# EAGLE design PCB-TLY-SHLD (EAGLE 6.4)
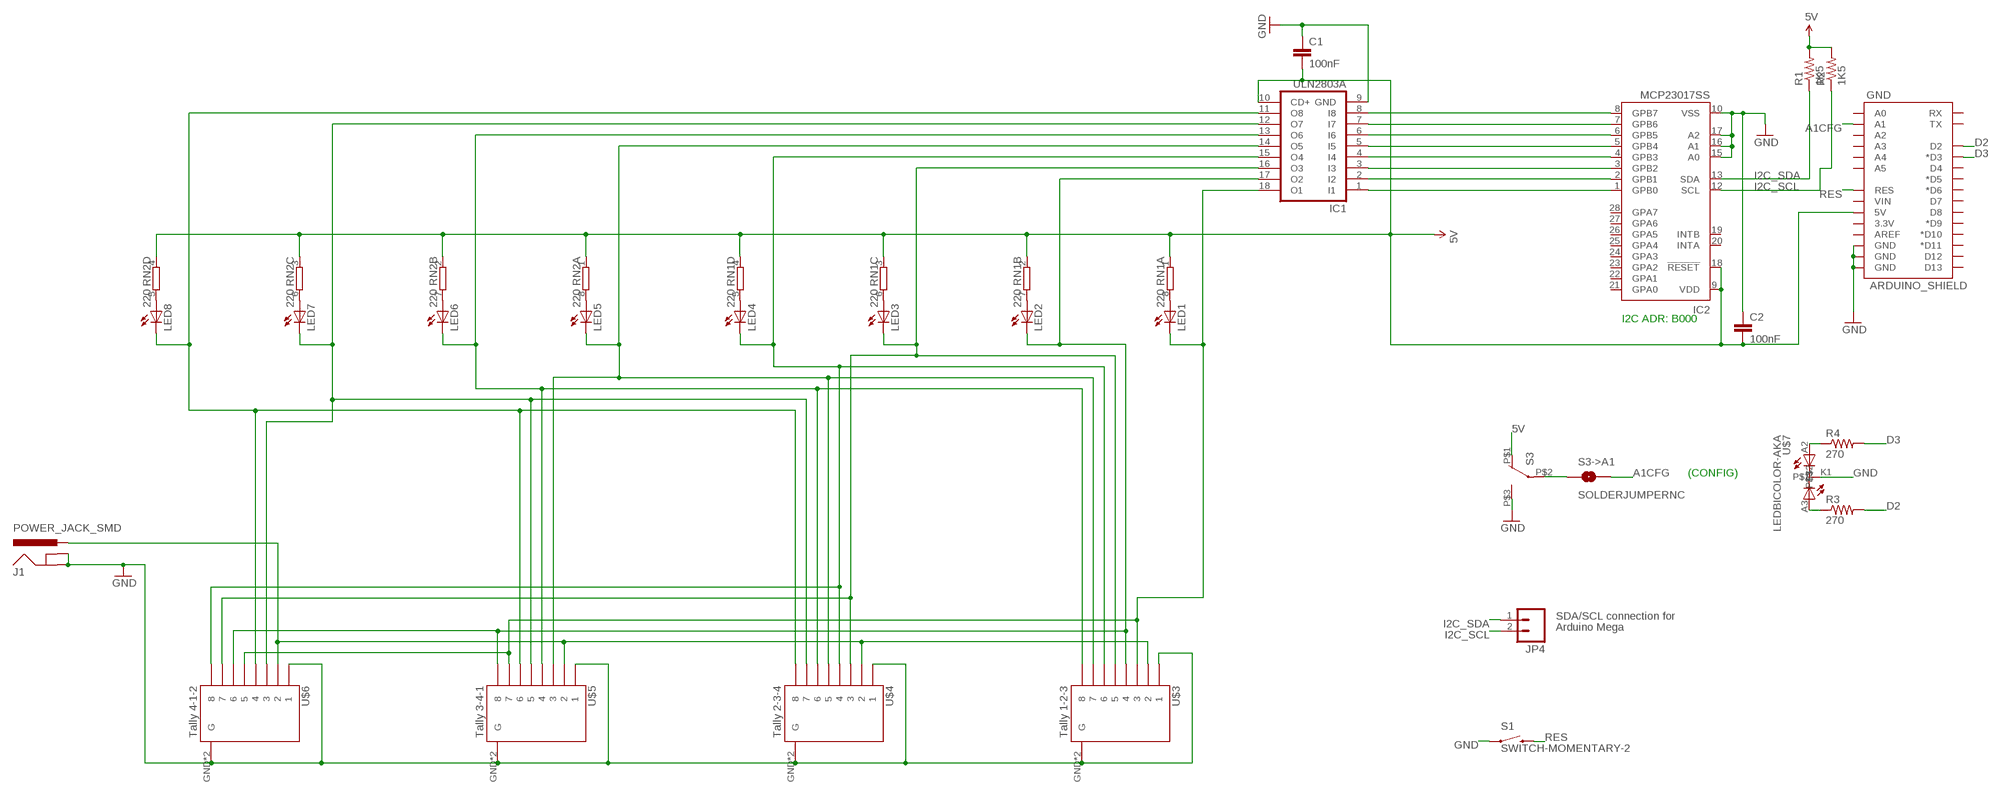
[diagram p0: schematic, sheet 1]

## Parts
C1  100nF  CAP0805  [0805]
C2  100nF  CAP0603-CAP  [0603-CAP]
GND  ARDUINO_SHIELD  [ARDUINO_BOXSHIELD_NOHOLES]
IC1  ULN2803A  ULN2803ASO18W  [SO18W]
IC2  MCP23017SS  [SSOP28]
J1  POWER_JACK_SMD  [POWER_JACK_SMD]
JP4  M02PTH  [1X02]
LED1  LEDSML0805  [SML0805]
LED2  LEDSML0805  [SML0805]
LED3  LEDSML0805  [SML0805]
LED4  LEDSML0805  [SML0805]
LED5  LEDSML0805  [SML0805]
LED6  LEDSML0805  [SML0805]
LED7  LEDSML0805  [SML0805]
LED8  LEDSML0805  [SML0805]
R1  1K5  RESISTOR0603-RES  [0603-RES]
R2  1K5  RESISTOR0603-RES  [0603-RES]
R3  270  RESISTOR0603-RES  [0603-RES]
R4  270  RESISTOR0603-RES  [0603-RES]
RN1  220  4R-NCAY16  [CAY16_HAND]
RN2  220  4R-NCAY16  [CAY16_HAND]
S1  SWITCH-MOMENTARY-2  [TACTILE_SWITCH_TALL]
S3  CFG  SWITCH-DPST  [TECONNECTIVITY-DPST]
S3->A1  SOLDERJUMPERNC  [SJ_2S]
U$3  Tally 1-2-3  RJ45-8_GND  [RJ45-8_GND]
U$4  Tally 2-3-4  RJ45-8_GND  [RJ45-8_GND]
U$5  Tally 3-4-1  RJ45-8_GND  [RJ45-8_GND]
U$6  Tally 4-1-2  RJ45-8_GND  [RJ45-8_GND]
U$7  LEDBICOLOR-AKA  [LED5MM-BICOLOR]

## Nets
5V [PWR]: C1.2 C2.2 GND.5V@0(5V) IC1.10(CD+) IC2.9(VDD) IC2.18(!RESET) R1.2 R2.2 RN1.1 RN1.2 RN1.3 RN1.4 RN2.1 RN2.2 RN2.3 RN2.4 S3.P$1(O)
A1CFG: GND.A1 S3->A1.2
D2: GND.2(D2) R3.2
D3: GND.3(*D3) R4.2
GND [PWR]: C1.1 C2.1 GND.GND@0(GND) GND.GND@1(GND) GND.GND@4(GND) IC1.9(GND) IC2.10(VSS) IC2.15(A0) IC2.16(A1) IC2.17(A2) J1.GND J1.SHUNT(GNDBREAK) S1.A2 S3.P$3(S) U$3.1 U$3.GND1(G) U$3.GND(G) U$4.1 U$4.GND1(G) U$4.GND(G) U$5.1 U$5.GND1(G) U$5.GND(G) U$6.1 U$6.GND1(G) U$6.GND(G) U$7.K1
I2C_SCL: IC2.12(SCL) JP4.2 R2.1
I2C_SDA: IC2.13(SDA) JP4.1 R1.1
N$2: IC1.18(O1) LED1.C U$3.3 U$5.7 U$6.5
N$3: S3->A1.1 S3.P$2(P)
N$4: J1.PWR U$3.2 U$4.2 U$5.2 U$6.2
N$5: IC1.1(I1) IC2.1(GPB0)
N$6: IC1.17(O2) LED2.C U$3.4 U$5.8 U$6.6
N$7: R4.1 U$7.A2
N$11: R3.1 U$7.A3
N$12: IC1.16(O3) LED3.C U$3.5 U$4.3 U$6.7
N$16: IC1.15(O4) LED4.C U$3.6 U$4.4 U$6.8
N$20: IC1.14(O5) LED5.C U$3.7 U$4.5 U$5.3
N$24: IC1.13(O6) LED6.C U$3.8 U$4.6 U$5.4
N$28: IC1.12(O7) LED7.C U$4.7 U$5.5 U$6.3
N$32: IC1.11(O8) LED8.C U$4.8 U$5.6 U$6.4
N$34: IC1.2(I2) IC2.2(GPB1)
N$35: IC1.3(I3) IC2.3(GPB2)
N$36: IC1.4(I4) IC2.4(GPB3)
N$37: IC1.5(I5) IC2.5(GPB4)
N$38: IC1.6(I6) IC2.6(GPB5)
N$39: IC1.7(I7) IC2.7(GPB6)
N$40: IC1.8(I8) IC2.8(GPB7)
N$41: LED1.A RN1.8
N$42: LED2.A RN1.7
N$43: LED3.A RN1.6
N$44: LED4.A RN1.5
N$45: LED5.A RN2.8
N$46: LED6.A RN2.7
N$47: LED7.A RN2.6
N$48: LED8.A RN2.5
RES: GND.RESET(RES) S1.B2
Unconnected: GND.0(RX) GND.1(TX) GND.3.3V GND.4(D4) GND.5(*D5) GND.6(*D6) GND.7(D7) GND.8(D8) GND.9(*D9) GND.10(*D10) GND.11(*D11) GND.12(D12) GND.13(D13) GND.A0 GND.A2 GND.A3 GND.A4 GND.A5 GND.AREF GND.VIN IC2.19(INTB) IC2.20(INTA) IC2.21(GPA0) IC2.22(GPA1) IC2.23(GPA2) IC2.24(GPA3) IC2.25(GPA4) IC2.26(GPA5) IC2.27(GPA6) IC2.28(GPA7)

## Notes on the sheet
- I2C ADR: B000
- (CONFIG)
- SDA/SCL connection for
- Arduino Mega

## Library data of the parts
C1 C2 = SparkFun:CAP: Capacitor Standard 0603 ceramic capacitor, and 0.1" leaded capacitor.
GND = SKAARHOJ:ARDUINO_SHIELD
IC1 = uln-udn:ULN2803A: DRIVER ARRAY
IC2 = microchip:MCP23017: http://ww1.microchip.com/downloads/en/DeviceDoc/21952a.pdf Source: http://ww1.microchip.com/downloads/en/DeviceDoc/21952a.pdf; MF: MICROCHIP; MPN: MCP23017-E/SS; OC_FARNELL: 1467674; OC_NEWARK: 31K2960
J1 = SKAARHOJ:POWER_JACK_SMD: RASM712PX Right Angle SMT Mount DC Power Jack, pin size 0.100"(2.5mm), with locating post Switchcraft.com
JP4 = SparkFun:M02: Header 2 Standard 2-pin 0.1" header. Use with straight break away headers (SKU : PRT-00116), right angle break away headers (PRT-00553), swiss pins (PRT-00743), machine pins (PRT-00117), and female headers (PRT-00115). Molex polarized connector foot print use with SKU : PRT-08233 with associated crimp pins and housings.
LED1-LED8 = led:LED: LED OSRAM: - CHIPLED LG R971, LG N971, LY N971, LG Q971, LY Q971, LO R971, LY R971 LH N974, LH R974 LS Q976, LO Q976, LY Q976 LO Q996 - Hyper CHIPLED LW Q18S LB Q993, LB Q99A, LB R99A - SideLED LS A670, LO A670, LY A670, LG A670, LP A670 LB A673, LV A673, LT A673, LW A673 LH A674 LY A675 LS A676, LA A676, LO A676, LY A676, LW A676 LS A679, LY A679, LG A679 - Hyper Micro SIDELED® LS Y876, LA Y876, LO Y876, LY Y876 LT Y87S - SmartLED LW L88C, LW L88S LB L89C, LB L89S, LG L890 LS L89K, LO L89K, LY L89K LS L896, LA L896, LO L896, LY L896 - TOPLED LS T670, LO T670, LY T670, LG T670, LP T670 LSG T670, LSP T670, LSY T670, LOP T670, LYG T670 LG T671, LOG T671, LSG T671 LB T673, LV T673, LT T673, LW T673 LH T674 LS T676, LA T676, LO T676, LY T676, LB T676, LH T676, LSB T676, LW T676 LB T67C, LV T67C, LT T67C, LS T67K, LO T67K, LY T67K, LW E67C LS E67B, LA E67B, LO E67B, LY E67B, LB E67C, LV E67C, LT E67C LW T67C LS T679, LY T679, LG T679 LS T770, LO T770, LY T770, LG T770, LP T770 LB T773, LV T773, LT T773, LW T773 LH T774 LS E675, LA E675, LY E675, LS T675 LS T776, LA T776, LO T776, LY T776, LB T776 LHGB T686 LT T68C, LB T68C - Hyper Mini TOPLED® LB M676 - Mini TOPLED Santana® LG M470 LS M47K, LO M47K, LY M47K Source: http://www.osram.convergy.de LUXEON: - LUMILED® LXK2-PW12-R00, LXK2-PW12-S00, LXK2-PW14-U00, LXK2-PW14-V00 LXK2-PM12-R00, LXK2-PM12-S00, LXK2-PM14-U00 LXK2-PE12-Q00, LXK2-PE12-R00, LXK2-PE12-S00, LXK2-PE14-T00, LXK2-PE14-U00 LXK2-PB12-K00, LXK2-PB12-L00, LXK2-PB12-M00, LXK2-PB14-N00, LXK2-PB14-P00, LXK2-PB14-Q00 LXK2-PR12-L00, LXK2-PR12-M00, LXK2-PR14-Q00, LXK2-PR14-R00 LXK2-PD12-Q00, LXK2-PD12-R00, LXK2-PD12-S00 LXK2-PH12-R00, LXK2-PH12-S00 LXK2-PL12-P00, LXK2-PL12-Q00, LXK2-PL12-R00 Source: www.luxeon.com KINGBRIGHT: KA-3528ASYC Source: www.kingbright.com
R1-R4 = SparkFun:RESISTOR: Resistor Basic schematic elements and footprints for 0603, 1206, and PTH resistors.
RN1 RN2 = SKAARHOJ:4R-N: Array Chip Resistor Source: RS Component / Phycomp; OC_FARNELL: unknown; OC_NEWARK: unknown
S1 = SparkFun:SWITCH-MOMENTARY-2
S3 = SKAARHOJ:SWITCH-DPST: DPDT Version of the COM-00597
S3->A1 = SparkFun:SOLDERJUMPER: Solder Jumper Standard SMD solder jumper. Used to automate production. Two varients : Normally Open and Normally Closed are the same, but have different paste layers. NC will have a large amount of paste and should jumper during reflow.
U$3-U$6 = SKAARHOJ:RJ45-8_GND
U$7 = SKAARHOJ:LEDBICOLOR-AKA

## Net classes
0 default: width 0.203 mm, drill 0.406 mm, clearance 0.203 mm
1 PWR: width 0.406 mm, drill 0.61 mm, clearance 0.203 mm
2 RELAY LINES: width 0.305 mm, clearance 0.254 mm
3 INput lines: clearance 0.254 mm

## Board
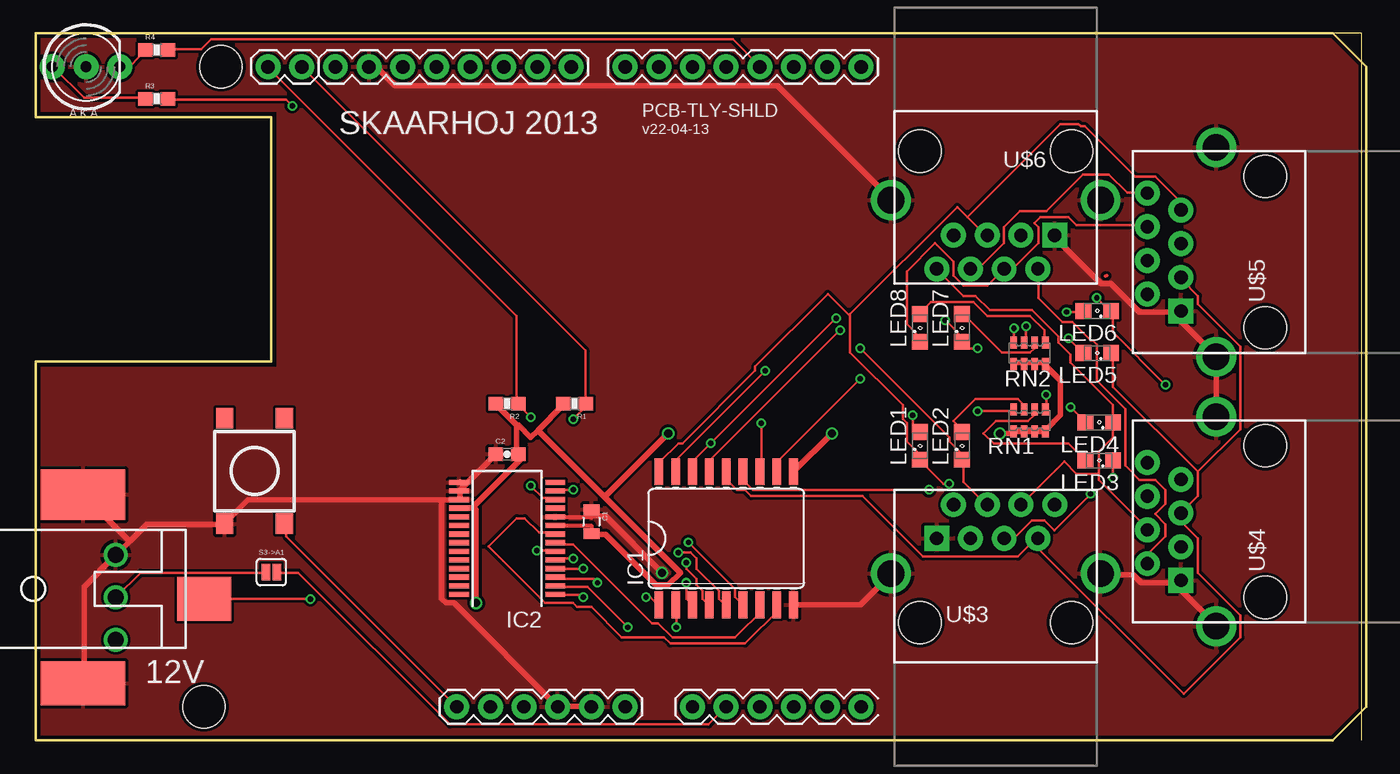
[diagram p1: board, top side]
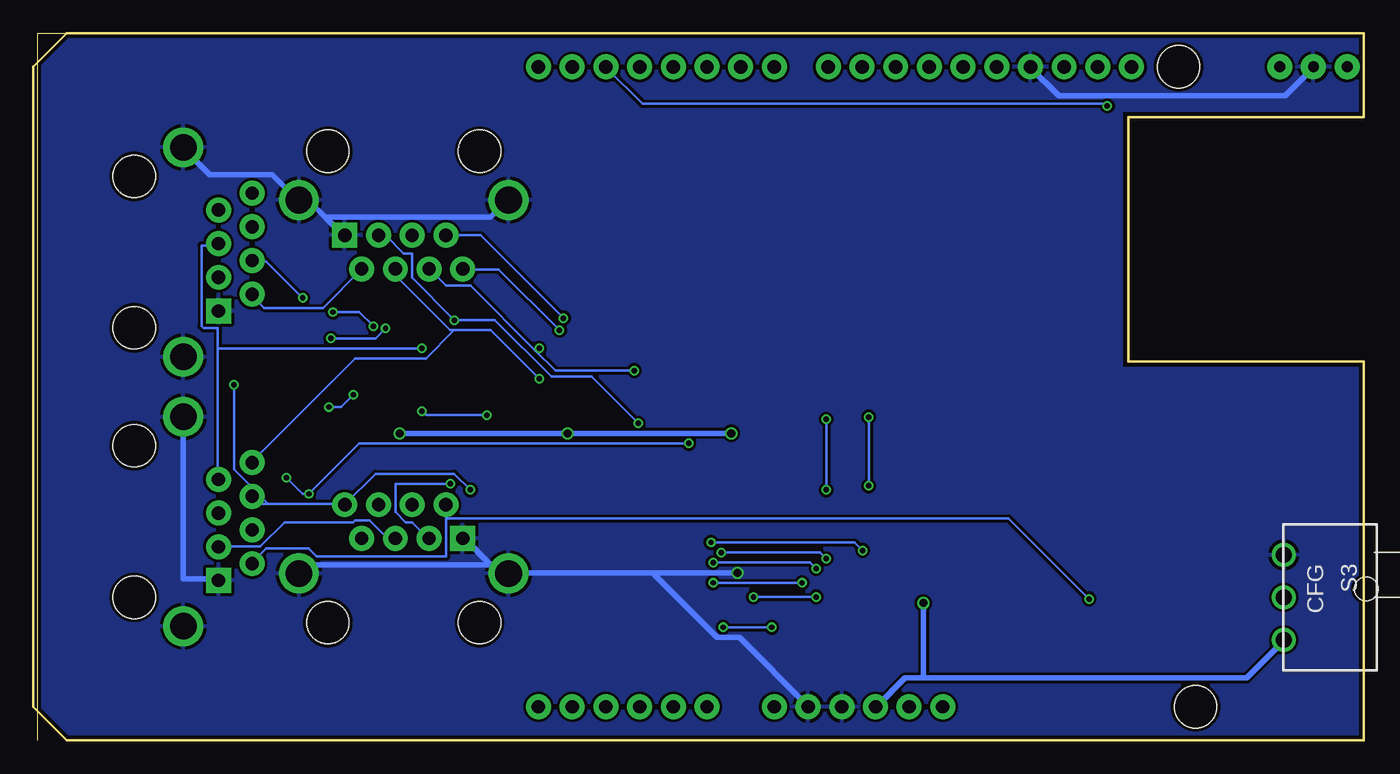
[diagram p2: board, bottom side, seen from below]

Size 100.33 x 53.34 mm. Coordinates in mm from the lower left corner, seen from the top.
Outline: 100,0 100,53.33 0,53.33
Copper layers (1*16): Top 0.035mm / dielectric 1.5mm / Bottom 0.035mm
Design rules "Fusion_eagle_rule_v1.1": minimum track width 6mil, minimum drill 12mil, track to track 6mil, track to pad 6mil, pad to pad 6mil, via to via 6mil, smd to smd 0mil, copper to edge 10mil, drill to drill 10mil, minimum pad ring 10mil, minimum via ring 6mil, stop-mask expansion 2mil, vias tented up to drill 100mil, thermal gap 10mil

### Footprints (pad centres in the part's own frame; a part is rotated, then mirrored left to right if it is on the bottom)
0805 = smd 0.8 x 1.2: 1 -0.9,0; 2 0.9,0
0603-CAP = smd 1.1 x 1: 1 -0.85,0; 2 0.85,0
ARDUINO_BOXSHIELD_NOHOLES = drill 1.016 pad 1.88: 0 62.23,50.8; 1 59.69,50.8; 2 57.15,50.8; 3 54.61,50.8; 3.3V 34.29,2.54; 4 52.07,50.8; 5 49.53,50.8; 5V@0 36.83,2.54; 6 46.99,50.8; 7 44.45,50.8; 8 40.386,50.8; 9 37.846,50.8; 10 35.306,50.8; 11 32.766,50.8; 12 30.226,50.8; 13 27.686,50.8; A0 49.53,2.54; A1 52.07,2.54; A2 54.61,2.54; A3 57.15,2.54; A4 59.69,2.54; A5 62.23,2.54; AREF 22.606,50.8; GND@0 39.37,2.54; GND@1 41.91,2.54; GND@4 25.146,50.8; RESET 31.75,2.54; VIN 44.45,2.54 | hole 3.2: 13.97,50.8; 12.7,2.54
SO18W = smd 0.66 x 2.032: 1 -5.08,-5.029; 2 -3.81,-5.029; 3 -2.54,-5.029; 4 -1.27,-5.029; 5 0,-5.029; 6 1.27,-5.029; 7 2.54,-5.029; 8 3.81,-5.029; 9 5.08,-5.029; 10 5.08,5.029; 11 3.81,5.029; 12 2.54,5.029; 13 1.27,5.029; 14 0,5.029; 15 -1.27,5.029; 16 -2.54,5.029; 17 -3.81,5.029; 18 -5.08,5.029
SSOP28 = smd 0.4 x 1.5: 1 -4.225,-3.625; 2 -3.575,-3.625; 3 -2.925,-3.625; 4 -2.275,-3.625; 5 -1.625,-3.625; 6 -0.975,-3.625; 7 -0.325,-3.625; 8 0.325,-3.625; 9 0.975,-3.625; 10 1.625,-3.625; 11 2.275,-3.625; 12 2.925,-3.625; 13 3.575,-3.625; 14 4.225,-3.625; 15 4.225,3.625; 16 3.575,3.625; 17 2.925,3.625; 18 2.275,3.625; 19 1.625,3.625; 20 0.975,3.625; 21 0.325,3.625; 22 -0.325,3.625; 23 -0.975,3.625; 24 -1.625,3.625; 25 -2.275,3.625; 26 -2.925,3.625; 27 -3.575,3.625; 28 -4.225,3.625
POWER_JACK_SMD = smd 6.35 x 3.81: GND -6.756,-7.112 | smd 4.064 x 3.302: PWR -15.9,0.762 | smd 6.35 x 3.302: SHUNT -6.756,7.112 | hole 1.778: -2.997,0
1X02 = drill 1.016 pad 1.88: 1 0,0; 2 2.54,0
SML0805 = smd 1.2 x 1.2: A 1.05,0; C -1.05,0
0603-RES = smd 1.1 x 1: 1 -0.85,0; 2 0.85,0
CAY16_HAND = smd 0.5 x 0.904: 1 -1.2,-0.813; 2 -0.4,-0.813; 3 0.4,-0.813; 4 1.2,-0.813; 5 1.2,0.813; 6 0.4,0.813; 7 -0.4,0.813; 8 -1.2,0.813
TACTILE_SWITCH_TALL = smd 1.55 x 1.3: A1 -3.975,-2.25; A2 3.975,-2.25; B1 -3.975,2.25; B2 3.975,2.25
TECONNECTIVITY-DPST = drill 1.2: P$1 3,3.2; P$2 3,0; P$3 3,-3.2
SJ_2S = smd 0.635 x 1.27: 1 -0.412,0; 2 0.412,0
RJ45-8_GND = drill 1 pad 1.88 square: 1 -4.445,6.35 | drill 1 pad 1.88: 2 -3.175,8.89; 3 -1.905,6.35; 4 -0.635,8.89; 5 0.635,6.35; 6 1.905,8.89; 7 3.175,6.35; 8 4.445,8.89 | drill 2: GND -7.9,3.7; GND1 7.9,3.7 | hole 3.2: -5.715,0; 5.715,0
LED5MM-BICOLOR = drill 0.813 pad 1.88: A2 2.54,0; A3 -2.54,0; K1 0,0

### Placement (x,y rotation side)
C1  41.91,16.51 270 top
C2  35.56,21.59 0 top
GND  0,0 0 top
IC1  52.07,15.24 0 top
IC2  35.56,15.24 90 top
J1  -3.17,11.43 180 top
JP4  20.07,50.8 180 top
LED1  66.67,22.23 90 top
LED2  69.85,22.23 90 top
LED3  80.19,21.11 180 top
LED4  80.19,23.98 180 top
LED5  80.04,29.21 180 top
LED6  80.04,32.38 180 top
LED7  69.85,31.11 90 top
LED8  66.67,31.11 90 top
R1  40.64,25.4 180 top
R2  35.56,25.4 180 top
R3  9.14,48.39 0 top
R4  9.14,52.07 0 top
RN1  74.93,24.13 0 top
RN2  74.93,29.21 0 top
S1  16.51,20.32 270 top
S3  3.05,10.79 180 bottom
S3->A1  17.78,12.7 0 top
U$3  72.39,8.89 0 top
U$4  92.71,16.51 90 top
U$5  92.71,36.83 90 top
U$6  72.39,44.45 180 top
U$7  3.81,50.8 0 top

### Tracks (layer width: path | path; a pad name or v marks a point on that pad's centre or on a via)
5V  (via drill 0.61)
  Top 0.305: IC2.9 41.91,16.21 C1.2
  Top 0.406: RN2.1 73.76,28.5 74.52,28.5 RN2.2 74.68,28.5 75.29,28.5 RN2.3 75.44,28.5 76.05,28.5 RN2.4 76.2,28.19 77.27,27.13 77.27,24.54 76.2,23.47 RN1.4 RN1.3 RN1.2 RN1.1 73.61,23.16 v72.69,23.16 | v60.05,23.16 IC1.10 | 36.27,23.77 36.27,21.64 C2.2 36.27,21.49 36.58,21.18 32.92,17.53 | 36.27,23.77 34.75,25.3 R2.2 | 37.87,23.39 37.34,22.86 36.42,23.77 36.27,23.77 | 37.87,23.39 39.78,25.3 R1.2 | 32.92,17.53 32,17.53 IC2.18 | 37.87,23.39 42.9,18.36 | 42.9,18.36 48.62,12.65 47.7,11.73 46.79,11.73 42.98,15.54 41.91,15.54 C1.2 | 42.9,18.36 v47.7,23.16 | v33.22,10.36 33.22,17.37 33.07,17.53 32.92,17.53
  Bottom 0.406: 33.22,4.72 34.59,4.72 36.73,2.59 GND.5V@0 | 33.22,4.72 8.84,4.72 6.1,7.47 S3.P$1 | v72.69,23.16 v60.05,23.16 v47.7,23.16 | v33.22,10.36 33.22,4.72
A1CFG
  Top 0.203: GND.A1 50.75,1.22 31.24,1.22 19.81,12.65 18.29,12.65 S3->A1.2
D2  (via drill 0.41)
  Top 0.203: v19.36,47.85 18.9,48.31 10.06,48.31 R3.2
  Bottom 0.203: v19.36,47.85 19.51,48.01 54.41,48.01 57.15,50.75 GND.2
D3
  Top 0.203: R4.2 10.06,52.12 12.5,52.12 13.26,52.88 52.58,52.88 54.56,50.9 GND.3
GND  (via drill 0.61)
  Top 0.305: IC2.10 41.91,16.86 | 41.91,16.92 C1.1
  Top 0.406: GND.GND@4 25.15,50.75 25.76,50.75 27.13,49.38 55.93,49.38 64.47,40.84 U$6.GND1 | 32.31,19.2 34.59,21.49 C2.1 | 32.31,19.2 32,19.51 IC2.15 | 32.31,19.2 32,18.9 IC2.16 32,18.75 32,18.29 IC2.17 31.85,18.14 30.63,18.14 | 7.09,15.01 6.1,14.02 S3.P$3 5.94,13.87 3.66,11.58 3.66,4.42 J1.SHUNT | 7.09,15.01 8.38,16.31 14.17,16.31 S1.A2 14.33,16.46 16,18.14 30.63,18.14 | 7.09,15.01 3.66,18.44 J1.GND | U$4.GND1 89,24.54 89,28.8 U$5.GND 89,28.96 86.41,31.55 86.41,32.31 U$5.1 86.26,32.31 83.21,32.31 81.08,34.44 80.31,34.44 76.96,37.8 76.96,38.1 U$6.1 | U$4.GND 89,8.69 86.41,11.28 86.41,12.04 U$4.1 86.26,11.89 83.36,11.89 82.75,12.5 80.31,12.5 U$3.GND1 | GND.GND@1 41.91,2.59 39.47,2.59 GND.GND@0 31.55,10.36 30.94,10.36 30.63,10.67 30.63,18.14 | IC1.9 62.18,10.21 64.47,12.5 U$3.GND | v47.24,12.65 42.98,16.92 41.91,16.92 41.91,16.86
  Bottom 0.406: U$7.K1 3.81,50.75 5.94,48.62 23.01,48.62 25.15,50.75 GND.GND@4 | 78.26,39.4 79.55,40.69 80.16,40.69 U$6.GND 80.47,40.84 82.3,42.67 87.02,42.67 89,44.65 U$5.GND1 | 78.26,39.4 76.96,38.1 U$6.1 | U$6.GND1 64.62,40.69 65.84,39.47 78.18,39.47 78.26,39.4 | U$4.GND1 89,24.38 89,12.19 86.41,12.19 U$4.1 | 53.49,12.65 64.47,12.65 U$3.GND 64.62,12.8 65.38,12.8 65.91,13.34 | 53.49,12.65 v47.24,12.65 | 65.91,13.34 67.82,15.24 U$3.1 | GND.GND@1 41.91,2.59 47.09,7.77 48.77,7.77 53.49,12.5 53.49,12.65 | U$3.GND1 80.16,12.65 79.55,13.26 65.99,13.26 65.91,13.34
  pour Bottom: 0,0 100.33,0 100.33,53.34 0,53.34
  pour Top: 0,0 100.33,0 100.33,53.34 0,53.34
I2C_SCL  (via drill 0.41)
  Top 0.203: JP4.2 17.53,50.75 36.27,32 36.27,25.45 R2.1 36.42,25.3 v37.34,24.38 | v37.34,19.2 38.25,18.29 39.17,18.29 IC2.12
  Bottom 0.203: v37.34,24.38 v37.34,19.2
I2C_SDA  (via drill 0.41)
  Top 0.203: JP4.1 41.45,29.41 41.45,25.45 R1.1 41.6,25.3 v40.54,24.23 | v40.54,18.9 39.32,18.9 IC2.13
  Bottom 0.203: v40.54,24.23 v40.54,18.9
N$1
  Top 0.254: 80.77,35.05 80.64,35.03
N$2  (via drill 0.41)
  Top 0.203: 61.42,32 61.42,32.16 69.49,40.23 70.26,39.47 | 61.42,32 61.42,29.26 65.38,25.3 65.38,24.23 65.68,23.93 65.68,22.55 66.6,21.64 66.6,21.18 LED1.C 66.75,21.03 68.43,19.36 v68.89,19.36 | 70.26,39.47 71.63,38.1 U$6.5 | 61.42,32 59.74,33.68 54.25,28.19 54.25,27.89 48.77,22.4 48.46,22.4 47.09,21.03 47.09,20.27 IC1.18 | 70.26,39.47 77.27,46.48 78.64,46.48 78.79,46.33 79.1,46.33 82.91,42.52 84.43,42.52 86.26,40.69 86.26,40.08 U$5.7
  Bottom 0.203: v68.89,19.36 73,19.36 73,17.22 72.24,16.46 71.78,16.46 70.56,15.24 U$3.3
N$3
  Top 0.203: S3->A1.1 17.22,12.65 7.92,12.65 6.1,10.82 S3.P$2
N$4  (via drill 0.41)
  Top 0.203: v20.73,10.67 J1.PWR | U$6.2 75.59,35.51 75.59,33.38 77.42,31.55 78.18,31.55 79.55,30.18 79.7,30.18 80.01,29.87 80.01,27.13 82.14,24.99 82.14,20.73 83.21,19.66 84.43,19.66 85.19,18.9 85.19,17.83 84.43,17.07 85.19,16.31 85.19,15.39 83.52,13.72 83.82,13.41 U$4.2
  Bottom 0.203: U$6.2 75.59,35.51 78.49,32.61 82.91,32.61 83.82,33.53 U$5.2 | 69.19,16.76 69.19,13.87 78.94,13.87 79.55,14.48 82.75,14.48 83.82,13.41 U$4.2 | 69.19,16.76 69.19,17.68 U$3.2 | v20.73,10.67 26.82,16.76 69.19,16.76
N$5  (via drill 0.41)
  Top 0.203: v41.3,10.82 41.15,10.97 39.32,10.97 IC2.1 | v46.02,10.82 46.33,10.82 46.94,10.21 IC1.1
  Bottom 0.203: v46.02,10.82 v41.3,10.82
N$6  (via drill 0.41)
  Top 0.203: U$3.4 71.63,17.83 69.95,19.51 69.95,21.03 LED2.C 69.8,21.18 69.8,21.64 68.89,22.55 68.89,22.86 v62.18,29.57 | v55.02,27.89 48.31,21.18 48.31,20.27 IC1.17 | U$5.8 83.82,41.3 82.3,41.3 80.92,42.67 78.94,42.67 76.2,39.93 74.22,39.93 73,38.71 73,37.49 70.87,35.36 70.56,35.66 U$6.6
  Bottom 0.203: v55.02,27.89 60.96,27.89 62.48,29.41 | 62.48,29.41 67.36,34.29 69.19,34.29 70.41,35.51 U$6.6 | v62.18,29.57 62.33,29.41 62.48,29.41
N$7
  Top 0.203: U$7.A2 6.71,50.44 8.23,51.97 R4.1
N$11
  Top 0.203: R3.1 8.23,48.46 3.66,48.46 1.37,50.75 U$7.A3
N$12  (via drill 0.41)
  Top 0.203: v81.23,19.81 81.23,21.03 LED3.C | v79.55,18.59 76.81,15.85 76.05,16.61 75.13,16.61 73.46,14.94 73.15,15.24 U$3.5 | IC1.16 49.53,21.03 v50.9,22.4 v60.35,31.85
  Bottom 0.203: v81.23,19.81 80.01,18.59 v79.55,18.59 75.74,22.4 v50.9,22.4 | U$3.5 73.61,15.24 74.98,16.61 76.05,16.61 76.2,16.46 81.38,16.46 83.21,14.63 86.26,14.63 U$4.3 | v60.35,31.85 66.6,38.1 U$6.7
N$16  (via drill 0.41)
  Top 0.203: 80.16,20.12 80.16,19.66 83.82,16 U$4.4 | 80.16,20.12 80.16,21.79 81.23,22.86 81.23,23.93 LED4.C 81.23,24.08 81.23,25.3 78.03,28.5 78.03,29.11 77.11,30.02 77.11,30.48 75.13,32.46 71.93,32.46 70.87,33.53 69.95,33.53 67.97,35.51 U$6.8 | 80.16,20.12 78.49,20.12 77.57,21.03 74.37,17.83 U$3.6 | v60.66,30.94 50.9,21.18 50.9,20.27 IC1.15
  Bottom 0.203: v60.66,30.94 65.23,35.51 67.82,35.51 U$6.8
N$20
  Top 0.203: 87.63,20.27 81.23,26.67 81.23,29.11 LED5.C | 87.63,20.27 87.63,18.44 86.41,17.22 U$4.5 86.41,17.07 86.41,16.46 87.63,15.24 87.63,12.65 90.83,9.45 90.83,7.77 86.56,3.5 75.13,14.94 | 87.63,20.27 90.83,23.47 90.83,29.72 87.63,32.92 87.63,33.53 86.41,34.75 86.41,34.9 U$5.3 | 75.13,14.94 75.44,15.24 U$3.7 75.13,14.94 | 75.13,14.94 74.07,13.87 66.9,13.87 62.33,18.44 53.95,18.44 53.49,18.9 52.88,18.9 52.12,19.66 52.12,20.27 IC1.14
N$24  (via drill 0.41)
  Top 0.203: v80.01,33.38 80.92,32.46 81.08,32.46 LED6.C 81.23,32.31 81.23,30.79 v85.19,26.82 | IC1.13 53.34,19.66 54.1,18.9 v67.36,18.9
  Bottom 0.203: v80.01,33.38 82.75,36.12 83.82,36.12 U$5.4 | v67.36,18.9 68.58,20.12 74.52,20.12 76.81,17.83 U$3.8 76.96,17.83 82.6,17.83 | 82.6,17.83 83.36,17.83 83.82,18.29 U$4.6 | v85.19,26.82 85.19,20.42 82.6,17.83
N$28  (via drill 0.41)
  Top 0.203: v68.58,31.7 69.8,30.48 69.8,30.18 LED7.C 69.95,30.02 70.41,29.57 v71.02,29.57 | v54.71,23.93 54.71,20.27 IC1.12
  Bottom 0.203: 86.41,29.57 86.41,31.09 87.48,31.09 87.63,31.24 87.63,37.34 86.41,37.34 U$5.5 | 86.41,29.57 86.41,19.81 U$4.7 | U$6.3 73.76,38.1 72.39,36.73 71.78,36.73 71.78,34.9 v68.58,31.7 65.53,31.7 61.27,27.43 58.22,27.43 v54.71,23.93 | v71.02,29.57 86.41,29.57
N$32  (via drill 0.41)
  Top 0.203: LED8.C 66.6,30.18 66.6,30.48 65.68,31.39 65.68,35.36 67.82,37.49 69.19,36.12 69.19,35.05 69.95,34.29 71.78,34.29 73,35.51 U$6.4 73.15,35.66 73.46,35.36 75.59,37.49 75.59,38.71 75.29,39.01 75.74,39.47 77.88,39.47 78.49,38.86 83.82,38.86 U$5.6 | v62.18,27.28 55.93,21.03 55.93,20.27 IC1.11
  Bottom 0.203: v62.18,27.28 65.84,30.94 68.58,30.94 | 68.58,30.94 68.89,30.94 73,35.05 73,35.51 U$6.4 | 68.58,30.94 70.71,28.8 76.05,28.8 83.82,21.03 U$4.8
N$34  (via drill 0.41)
  Top 0.203: v44.65,8.53 41.6,11.58 39.32,11.58 IC2.2 | v48.31,8.53 48.31,10.21 IC1.2
  Bottom 0.203: v48.31,8.53 v44.65,8.53
N$35  (via drill 0.41)
  Top 0.203: v42.37,11.89 42.06,12.19 39.32,12.19 IC2.3 | v49.07,11.89 49.07,10.67 IC1.3
  Bottom 0.203: v49.07,11.89 v42.37,11.89
N$36  (via drill 0.41)
  Top 0.203: v41.3,12.95 39.32,12.95 IC2.4 | v49.07,13.41 49.07,12.95 49.84,12.19 49.84,11.73 50.29,11.28 50.29,10.67 50.75,10.21 IC1.4
  Bottom 0.203: v41.3,12.95 41.76,13.41 v49.07,13.41
N$37  (via drill 0.41)
  Top 0.203: v40.54,13.72 39.32,13.72 IC2.5 | v48.46,14.17 49.38,14.17 49.84,13.72 49.84,12.95 51.51,11.28 51.51,10.67 51.97,10.21 IC1.5
  Bottom 0.203: v40.54,13.72 41,14.17 v48.46,14.17
N$38  (via drill 0.41)
  Top 0.203: v37.8,14.33 39.17,14.33 IC2.6 | v49.23,14.94 52.73,11.43 52.73,10.82 IC1.6
  Bottom 0.203: v37.8,14.33 38.41,14.94 v49.23,14.94
N$39
  Top 0.203: IC2.7 39.32,14.78 40.54,14.78 46.48,8.84 46.94,8.84 48.01,7.77 52.73,7.77 54.86,9.91 54.56,10.21 IC1.7
N$40
  Top 0.203: IC2.8 39.17,15.7 37.95,15.7 36.88,16.76 36.27,16.76 34.14,14.63 38.41,10.36 40.54,10.36 40.84,10.06 41.91,10.06 44.2,7.77 47.4,7.77 47.85,7.32 53.49,7.32 56.08,9.91 55.78,10.21 IC1.8
N$41  (via drill 0.41)
  Top 0.203: v71.02,24.84 73.61,24.84 RN1.8 | v66.14,24.54 66.14,23.77 66.6,23.32 LED1.A
  Bottom 0.203: v71.02,24.84 70.71,24.54 v66.14,24.54
N$42
  Top 0.203: RN1.7 74.52,24.99 74.52,25.3 74.07,25.76 70.87,25.76 69.19,24.08 69.95,23.32 LED2.A
N$43
  Top 0.203: RN1.6 75.29,24.84 75.29,24.54 74.83,24.08 72.39,24.08 71.48,23.16 72.24,22.4 77.88,22.4 79.1,21.18 LED3.A
N$44  (via drill 0.41)
  Top 0.203: v76.2,26.06 76.2,24.99 RN1.5 | v78.03,25.15 79.1,24.08 LED4.A
  Bottom 0.203: v76.2,26.06 77.11,25.15 v78.03,25.15
N$45  (via drill 0.41)
  Top 0.203: v73.76,31.09 73.76,30.02 RN2.8 | v77.88,30.33 78.94,29.26 LED5.A
  Bottom 0.203: v73.76,31.09 74.52,30.33 v77.88,30.33
N$46  (via drill 0.41)
  Top 0.203: v74.68,31.24 74.68,30.02 RN2.7 | v77.72,32.31 78.94,32.31 LED6.A
  Bottom 0.203: v74.68,31.24 75.74,32.31 v77.72,32.31
N$47
  Top 0.203: RN2.6 75.29,30.02 75.29,29.57 74.98,29.26 72.85,29.26 69.95,32.16 LED7.A
N$48
  Top 0.203: RN2.5 76.05,30.02 76.05,30.94 74.98,32 71.78,32 70.71,33.07 67.51,33.07 66.75,32.31 LED8.A
RES
  Top 0.203: GND.RESET 18.9,15.39 18.9,16.31 S1.B2

### Text on the board
_tsilk: PCB-TLY-SHLD | SKAARHOJ 2013 | v22-04-13 | 12V